# EAGLE schematic RefOsc10MHz_1V0 (EAGLE 7.2.0)
DF4IAH - 10 MHz Reference Oscillator
Assembly variants: Crystal, TCXO
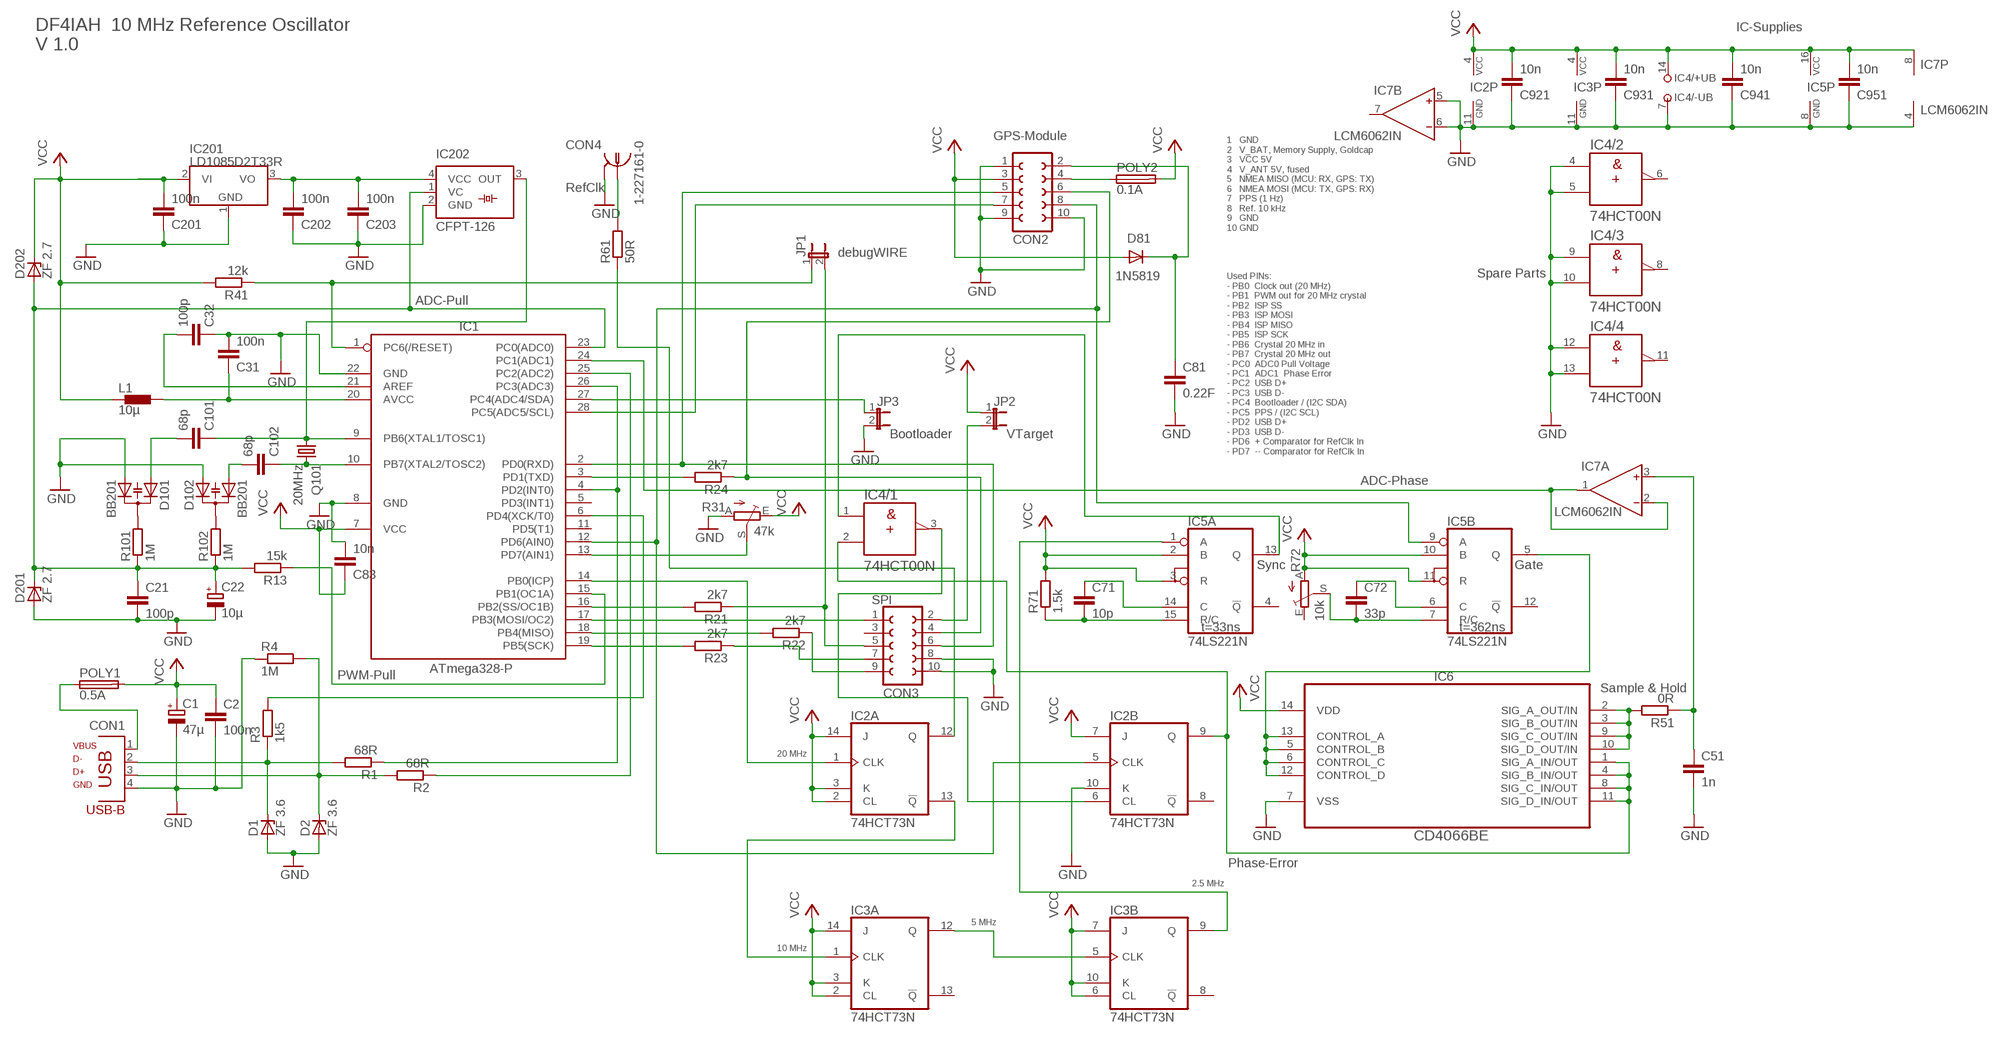
[diagram p0: schematic, sheet 1]

## Parts
C1  47µ  CPOL-EUE2-4  [E2-4]
C2  100n  C5/3  [C5B3]
C21  100p  C5/3  [C5B3]
C22  10µ  CPOL-EUE2-4  [E2-4]
C31  100n  C5/3  [C5B3]
C32  100p  C5/3  [C5B3]
C51  1n  C5/3  [C5B3]
C71  10p  C5/3  [C5B3]
C72  33p  C5/3  [C5B3]
C81  0.22F  C5/7.2  [C5B7.2]
C83  10n  C5/3  [C5B3]
C101  68p  C5/3  [C5B3]  (not fitted in variant TCXO)
C102  68p  C5/3  [C5B3]  (not fitted in variant TCXO)
C201  100n  C5/3  [C5B3]  (not fitted in variant Crystal)
C202  100n  C5/3  [C5B3]  (not fitted in variant Crystal)
C203  100n  C5/3  [C5B3]  (not fitted in variant Crystal)
C921  10n  C5/3  [C5B3]
C931  10n  C5/3  [C5B3]
C941  10n  C5/3  [C5B3]
C951  10n  C5/3  [C5B3]
CON1  PN61729  [PN61729]
CON2  FE05-2  [FE05-2]
CON3  FE05-2  [FE05-2]
CON4  1-227161-0  [AMP_227161]
D1  ZF 3.6  1N4728  [DO41Z10]
D2  ZF 3.6  1N4728  [DO41Z10]
D81  1N5819  1N4942  [DO41-10]
D101  BB201  BBY51  [SOT23]  (not fitted in variant TCXO)
D102  BB201  BBY51  [SOT23]  (not fitted in variant TCXO)
D201  ZF 2.7  1N4728  [DO41Z10]  (not fitted in variant Crystal)
D202  ZF 2.7  1N4728  [DO41Z10]  (not fitted in variant Crystal)
IC1  ATmega328-P  MEGA8-P  [DIL28-3]
IC2  74HCT73N  74LS73N  [DIL14]
IC3  74HCT73N  74LS73N  [DIL14]
IC4  74HCT00N  [DIL14]
IC5  74LS221N  [DIL16]
IC6  CD4066BE  [DIP254P762X508-14]
IC7  LCM6062IN  AD822IN  [DIL08]
IC201  LD10853.3  [TO220V]  (not fitted in variant Crystal)
IC202  CFPT-126  [SM77H]  (not fitted in variant Crystal)
JP1  JP1E  [JP1]
JP2  JP1E  [JP1]
JP3  JP1E  [JP1]
L1  10µ  BL01RN1A  [BL01RN1A]
POLY1  0.5A  FUSETE5  [TE5]
POLY2  0.1A  FUSETE5  [TE5]
Q101  20MHz  CRYSTALHC49U70  [HC49U70]  (not fitted in variant TCXO)
R1  68R  R-EU_0204/7  [0204/7]
R2  68R  R-EU_0204/7  [0204/7]
R3  1k5  R-EU_0204/7  [0204/7]
R4  1M  R-EU_0204/7  [0204/7]
R13  15k  R-EU_0204/7  [0204/7]
R21  2k7  R-EU_0204/7  [0204/7]
R22  2k7  R-EU_0204/7  [0204/7]
R23  2k7  R-EU_0204/7  [0204/7]
R24  2k7  R-EU_0204/7  [0204/7]
R31  47k  TRIM_1234-S64YW  [S64YW]
R41  12k  R-EU_0204/7  [0204/7]
R51  0R  R-EU_0204/7  [0204/7]
R61  50R  R-EU_0204/7  [0204/7]
R71  1.5k  R-EU_0204/7  [0204/7]
R72  10k  TRIM_1234-S64YW  [S64YW]
R101  1M  R-EU_0204/7  [0204/7]  (not fitted in variant TCXO)
R102  1M  R-EU_0204/7  [0204/7]  (not fitted in variant TCXO)

## Nets
GND [N0V]: C1.- C2.2 C21.2 C22.- C31.2 C32.1 C51.2 C81.2 C83.2 C201.1 C202.1 C203.1 C921.1 C931.1 C941.1 C951.1 CON1.4 CON2.1 CON2.9 CON2.10 CON3.8 CON3.10 CON4.2 D1.A D2.A D101.2(A2) D102.1(A1) D201.A IC1.8(GND) IC1.22(GND) IC2.10(B:K) IC2.11(P:GND) IC3.11(P:GND) IC4.4(/2:A) IC4.5(/2:B) IC4.7(/-UB:-UB) IC4.9(/3:A) IC4.10(/3:B) IC4.12(/4:A) IC4.13(/4:B) IC5.8(P:GND) IC6.7(VSS) IC7.4(P:V-) IC7.5(B:IN+) IC7.6(B:IN-) IC201.1(GND) IC202.2(GND) JP3.2 R4.1 R31.A
N3V3 [N3V3]: C202.2 C203.2 IC201.3(VO) IC202.4(VCC)
N$1: C101.1 IC1.9(PB6(XTAL1/TOSC1)) IC202.3(OUT) Q101.1
N$2: C102.1 IC1.10(PB7(XTAL2/TOSC2)) Q101.2
N$3: D102.3(C) R102.2
N$4: C101.2 D101.1(A1)
N$5: C21.1 C22.+ D201.C D202.A IC1.23(PC0(ADC0)) IC202.1(VC) R13.2 R101.1 R102.1
N$6: CON1.2 D1.C R1.2 R3.1
N$7: CON1.3 D2.C R2.2 R4.2
N$8: IC1.4(PD2(INT0)) IC1.26(PC3(ADC3)) R1.1
N$9: IC1.25(PC2(ADC2)) R2.1
N$10: IC1.16(PB2(SS/OC1B)) R21.2
N$11: CON3.1 IC1.17(PB3(MOSI/OC2))
N$12: IC1.19(PB5(SCK)) R23.2
N$13: C31.1 IC1.20(AVCC) L1.2
N$14: IC1.18(PB4(MISO)) R22.2
N$15: CON3.5 JP1.2 R21.1
N$16: CON3.9 R22.1
N$17: CON3.7 R23.1
N$18: IC1.3(PD1(TXD)) R24.2
N$19: IC1.14(PB0(ICP)) IC2.1(A:CLK)
N$20: CON2.5 CON3.6 IC1.2(PD0(RXD))
N$21: CON2.6 CON3.4 R24.1
N$22: IC1.1(PC6(/RESET)) JP1.1 R41.1
N$23: CON3.2 JP2.2
N$24: CON2.8 IC1.12(PD6(AIN0)) IC2.5(B:CLK) IC5.9(B:A)
N$25: IC1.13(PD7(AIN1)) R31.S
N$26: IC1.15(PB1(OC1A)) R13.1
N$27: C32.2 IC1.21(AREF)
N$28: IC1.27(PC4(ADC4/SDA)) JP3.1
N$29: C102.2 D102.2(A2)
N$30: D101.3(C) R101.2
N$31: IC2.12(A:Q) R61.1
N$32: IC2.9(B:Q) IC4.2(/1:B) IC6.1(SIG_A_IN/OUT) IC6.4(SIG_B_IN/OUT) IC6.8(SIG_C_IN/OUT) IC6.11(SIG_D_IN/OUT)
N$33: IC6.2(SIG_A_OUT/IN) IC6.3(SIG_B_OUT/IN) IC6.9(SIG_C_OUT/IN) IC6.10(SIG_D_OUT/IN) R51.2
N$34: C51.1 IC7.3(A:IN+) R51.1
N$35: IC2.6(B:CL) IC4.3(/1:Y)
N$36: IC5.5(B:Q) IC6.5(CONTROL_B) IC6.6(CONTROL_C) IC6.12(CONTROL_D) IC6.13(CONTROL_A)
N$37: IC1.24(PC1(ADC1)) IC7.1(A:OUT) IC7.2(A:IN-)
N$38 [N5V]: CON1.1 POLY1.1
N$39 [N5V]: CON2.4 POLY2.1
N$40: CON2.7 IC1.28(PC5(ADC5/SCL))
N$41: IC1.6(PD4(XCK/T0)) R3.2
N$42: CON4.1 R61.2
N$43: IC4.1(/1:A) IC5.13(A:Q)
N$44: C72.2 IC5.7(B:R/C) R72.S
N$45: C72.1 IC5.6(B:C)
N$46: IC3.9(B:Q) IC5.1(A:A)
N$47: C71.2 IC5.15(A:R/C) R71.1
N$48: C71.1 IC5.14(A:C)
N$49: IC2.13(A:!Q) IC3.1(A:CLK)
N$50: IC3.5(B:CLK) IC3.12(A:Q)
N$51 [N0V]: C81.1 CON2.2 D81.C
VCC [N5V]: C1.+ C2.1 C83.1 C201.2 C921.2 C931.2 C941.2 C951.2 CON2.3 D81.A D202.C IC1.7(VCC) IC2.2(A:CL) IC2.3(A:K) IC2.4(P:VCC) IC2.7(B:J) IC2.14(A:J) IC3.2(A:CL) IC3.3(A:K) IC3.4(P:VCC) IC3.6(B:CL) IC3.7(B:J) IC3.10(B:K) IC3.14(A:J) IC4.14(/+UB:+UB) IC5.2(A:B) IC5.3(A:R) IC5.10(B:B) IC5.11(B:R) IC5.16(P:VCC) IC6.14(VDD) IC7.8(P:V+) IC201.2(VI) JP2.1 L1.1 POLY1.2 POLY2.2 R31.E R41.2 R71.2 R72.A
Unconnected: CON3.3 IC1.5(PD3(INT1)) IC1.11(PD5(T1)) IC2.8(B:!Q) IC3.8(B:!Q) IC3.13(A:!Q) IC4.6(/2:Y) IC4.8(/3:Y) IC4.11(/4:Y) IC5.4(A:!Q) IC5.12(B:!Q) IC7.7(B:OUT) R31.S@1(S) R72.E R72.S@1(S)

## Notes on the sheet
- IC-Supplies
- DF4IAH  10 MHz Reference Oscillator
  V 1.0
- GPS-Module
- RefClk
- 1   GND
  2   V_BAT, Memory Supply, Goldcap
  3   VCC 5V
  4   V_ANT 5V, fused
  5   NMEA MISO (MCU: RX, GPS: TX)
  6   NMEA MOSI (MCU: TX, GPS: RX)
  7   PPS (1 Hz)
  8   Ref. 10 kHz
  9   GND
  10 GND
- debugWIRE
- Spare Parts
- ADC-Pull
- Bootloader | VTarget
- Used PINs:
  - PB0  Clock out (20 MHz)
  - PB1  PWM out for 20 MHz crystal
  - PB2  ISP SS
  - PB3  ISP MOSI
  - PB4  ISP MISO
  - PB5  ISP SCK
  - PB6  Crystal 20 MHz in
  - PB7  Crystal 20 MHz out
  - PC0  ADC0 Pull Voltage
  - PC1  ADC1  Phase Error
  - PC2  USB D+
  - PC3  USB D-
  - PC4  Bootloader / (I2C SDA)
  - PC5  PPS / (I2C SCL)
  - PD2  USB D+
  - PD3  USB D-
  - PD6  + Comparator for RefClk In
  - PD7  -- Comparator for RefClk In
- ADC-Phase
- Sync | Gate
- SPI
- t=33ns | t=362ns
- PWM-Pull
- Sample & Hold
- VBUS
- 20 MHz
- D-
- D+
- GND
- USB-B
- Phase-Error
- 2.5 MHz
- 5 MHz
- 10 MHz

## Library data of the parts
C1 C22 = rcl:CPOL-EU: POLARIZED CAPACITOR, European symbol
C2 C21 C31 C32 C51 C71 C72 C81 C83 C101 C102 C201-C203 C921 C931 C941 C951 = capacitor-wima:C: CAPACITOR naming: grid - package width
CON1 = con-berg:PN61729: BERG USB connector; OC_FARNELL: unknown; OC_NEWARK: unknown
CON2 CON3 = con-lsta:FE05-2: FEMALE HEADER; OC_FARNELL: unknown; OC_NEWARK: unknown
CON4 = con-coax:?227161*: JACK, RIGHT ANGLE, 50 OHM, PCB, BNC Source: amp_227161.pdf; MF: TYCO ELECTRONICS; MPN: 1-227161; OC_FARNELL: unknown; OC_NEWARK: 33B3200
D1 D2 D201 D202 = diode:1N4728: Z DIODE 3.3 V, 1W, 5 percent
D81 = diode:1N4942: DIODE 1.0 A, 200 V, 150 ns
D101 D102 = diode:BBY51: Capacity DIODE variable-capacitance diode (Infineon)
IC1 = atmel:MEGA8-P: MICROCONTROLLER 8 Kbytes FLASH, 1 kbytes SRAM, 512 bytes EEPROM, USART, 4-channel 10 bit ADC, 2-channel 8 bit ADC Pin compatible with Atmega48, ATMega88, ATMega168 Source: avr.lbr; OC_FARNELL: unknown; OC_NEWARK: unknown
IC2 IC3 = 74xx-eu:74*73: Dual J-K FLIP FLOP, clear
IC4 = 74ttl-din:74*00: Quad 2-input NAND gate
IC5 = 74xx-eu:74*221: Dual Monostable MULTIVIBRATOR, schmitt trigger inputs
IC6 = Texas Instruments_By_element14_Batch_1:CD4066BE: CMOS Quad Bilateral Switch; MPN: CD4066BE; OC_FARNELL: 1106112; OC_NEWARK: 60K5124; PACKAGE: PDIP-14; SUPPLIER: Texas Instruments
IC7 = lmc6082n:AD822: Single-Supply, Rail-to-Rail Low Power FET-Input Op Amp Source: http://www.ti.com/lit/ds/symlink/lmc6062.pdf; OC_FARNELL: unknown; OC_NEWARK: 41K2618
IC201 = linear:LD1085
IC202 = crystal:CFPT-126
JP1-JP3 = jumper:JP1E: JUMPER
L1 = inductors:BL0: Noise Suppression Products/EMI Suppression Filters, Lead EMIFIL(R) Inductor Type Source: http://www.murata.com .. BL01RN1_DS.pdf
POLY1 POLY2 = fuse:FUSE: Fuse; OC_FARNELL: unknown; OC_NEWARK: unknown
Q101 = crystal:CRYSTAL: CRYSTAL; OC_FARNELL: unknown; OC_NEWARK: unknown
R1-R4 R13 R21-R24 R41 R51 R61 R71 R101 R102 = resistor:R-EU_: RESISTOR, European symbol
R31 R72 = pot:TRIM_1234-: POTENTIOMETER

## Net classes
1 N3V3: width 1.27 mm
2 N5V: width 0.762 mm
3 N0V: width 0.762 mm